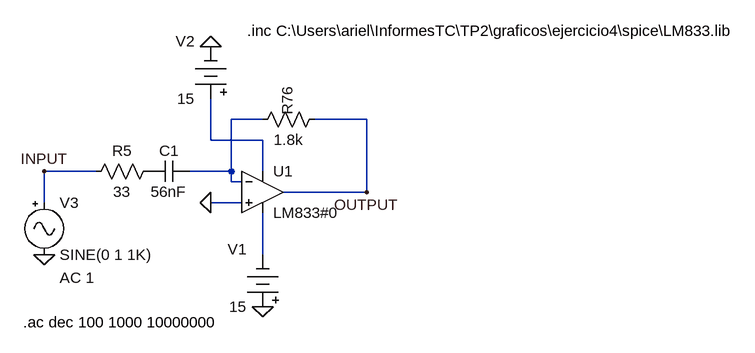
[diagram p0: schematic derivador_compensado.asc]
derivador_compensado.asc, the LTspice schematic file:
Version 4
SHEET 1 1332 680
WIRE 320 304 272 304
WIRE 480 304 400 304
WIRE 240 336 240 272
WIRE 320 336 240 336
WIRE 64 384 -16 384
WIRE 272 384 272 304
WIRE 272 384 208 384
WIRE 320 384 320 336
WIRE 272 400 272 384
WIRE 288 400 272 400
WIRE 480 416 480 304
WIRE 480 416 352 416
WIRE -16 432 -16 384
WIRE 288 432 240 432
WIRE 320 512 320 448
FLAG 480 416 OUTPUT
FLAG 240 192 0
FLAG 320 592 0
FLAG -16 512 0
FLAG -16 384 INPUT
FLAG 240 432 0
SYMBOL Misc\\battery 320 608 R180
WINDOW 0 24 104 Left 2
WINDOW 3 24 16 Left 2
WINDOW 123 0 0 Left 2
WINDOW 39 0 0 Left 2
SYMATTR InstName V1
SYMATTR Value 15
SYMBOL Misc\\battery 240 288 R180
WINDOW 0 24 104 Left 2
WINDOW 3 24 16 Left 2
WINDOW 123 0 0 Left 2
WINDOW 39 0 0 Left 2
SYMATTR InstName V2
SYMATTR Value 15
SYMBOL Misc\\signal -16 416 R0
WINDOW 123 24 132 Left 2
WINDOW 39 24 160 Left 2
SYMATTR Value2 AC 1
SYMATTR InstName V3
SYMBOL res 416 288 R90
WINDOW 0 -13 42 Top 2
WINDOW 3 32 56 VTop 2
SYMATTR InstName R76
SYMATTR Value 1.8k
SYMBOL Opamps\\opamp2 320 352 R0
SYMATTR InstName U1
SYMATTR Value LM833#0
SYMBOL cap 144 368 M90
WINDOW 0 0 32 VBottom 2
WINDOW 3 32 32 VTop 2
SYMATTR InstName C1
SYMATTR Value 56nF
SYMBOL res 160 368 R90
WINDOW 0 0 56 VBottom 2
WINDOW 3 32 56 VTop 2
SYMATTR InstName R5
SYMATTR Value 33
TEXT 296 168 Left 2 !.inc C:\\Users\\ariel\\InformesTC\\TP2\\graficos\\ejercicio4\\spice\\LM833.lib
TEXT -48 616 Left 2 !.ac dec 100 1000 10000000

The netlist it stands for:
* derivador_compensado.asc
V1 0 N003 15
V2 N002 0 15
V3 INPUT 0 SINE(0 1 1K) AC 1
R76 OUTPUT N001 1.8k
XU1 0 N001 N002 N003 OUTPUT LM833#0  ; pins In+ In- V+ V- OUT
C1 P001 N001 56nF
R5 P001 INPUT 33
.inc C:\Users\ariel\InformesTC\TP2\graficos\ejercicio4\spice\LM833.lib
.ac dec 100 1000 10000000
.backanno
.end